# Altium project SparkIO Thermal Shield.PrjPCB
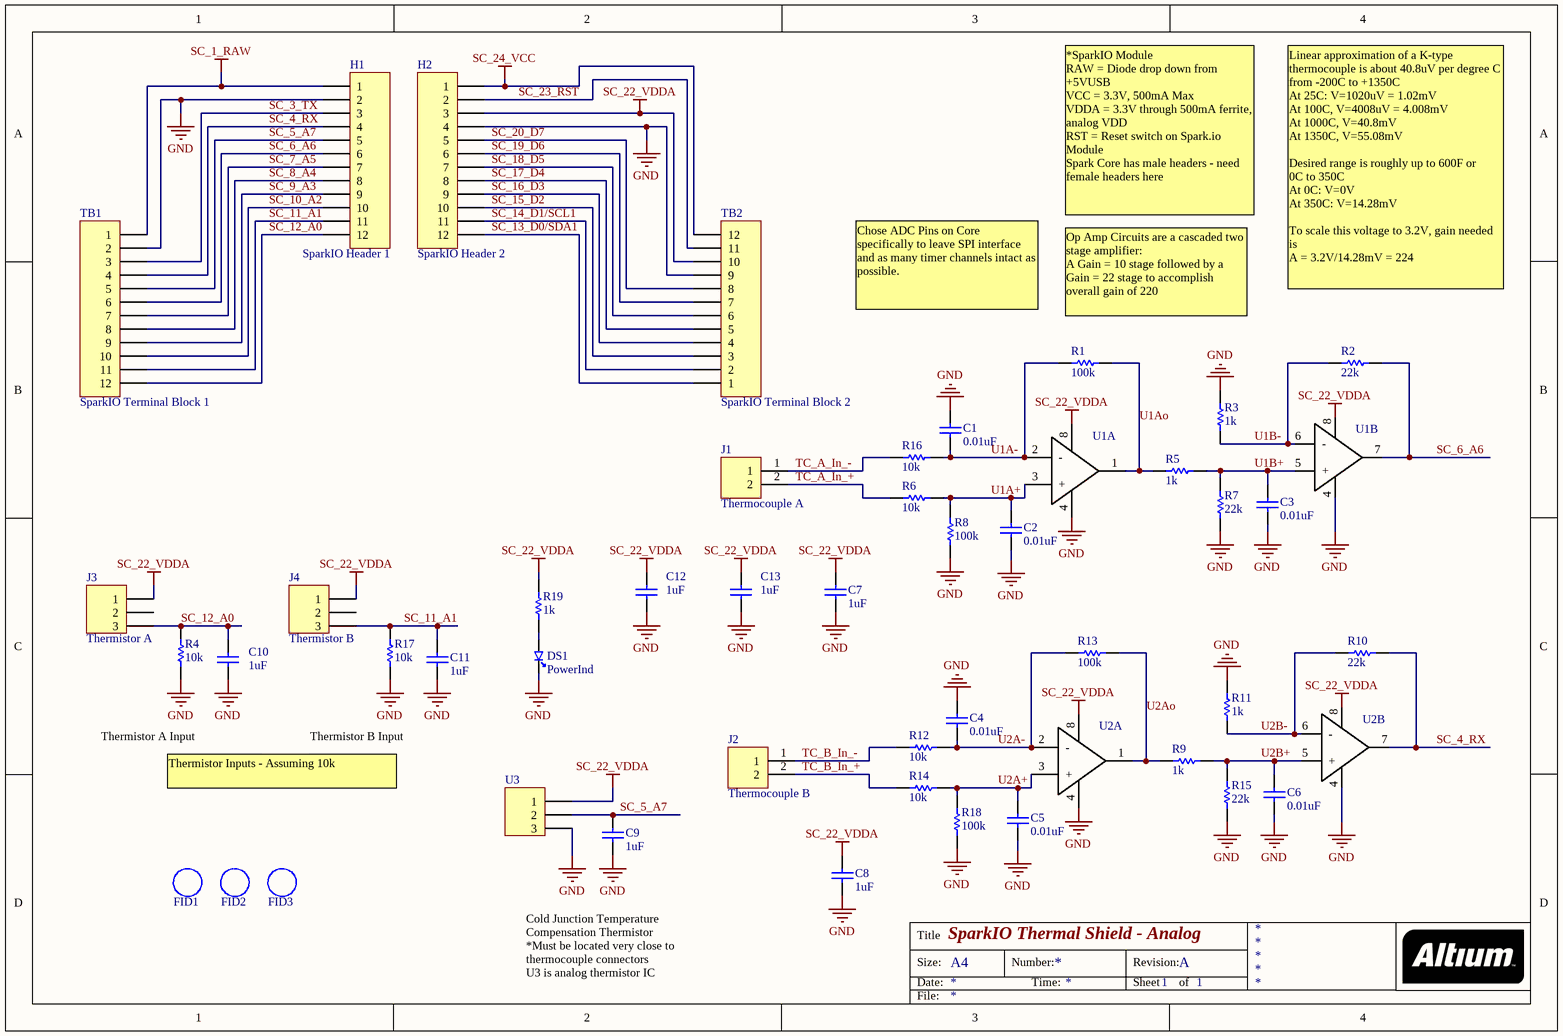
[diagram p0: SparkIO Thermal Shield - No Aux ADC.SchDoc]
1 sheet, 47 parts. Net scope: global (net labels, ports and power ports of the same name join across sheets).
Board files: SparkIO Thermal Shield - Solo PCB.PcbDoc, SparkIO Thermal Shield - Panelized 18x24.PcbDoc, SparkIO Thermal Shield.PcbDoc

## Sheet SparkIO Thermal Shield - No Aux ADC.SchDoc: SparkIO Thermal Shield - Analog
size A4; DrawnBy: Jim Griszbacher; Engineer: Jim Griszbacher; Revision: A; SheetNumber: 1; SheetTotal: 1; ProjectName: SparkIO Thermal Shield

### Parts
C1  value 0.01uF  [0603 - NO SILK]  (hidden comment: Capacitor)
C2  value 0.01uF  [0603 - NO SILK]  (hidden comment: Capacitor)
C3  value 0.01uF  [0603 - NO SILK]  (hidden comment: Capacitor)
C4  value 0.01uF  [0603 - NO SILK]  (hidden comment: Capacitor)
C5  value 0.01uF  [0603 - NO SILK]  (hidden comment: Capacitor)
C6  value 0.01uF  [0603 - NO SILK]  (hidden comment: Capacitor)
C7  value 1uF  [0603 - NO SILK]  (hidden comment: Capacitor)
C8  value 1uF  [0603 - NO SILK]  (hidden comment: Capacitor)
C9  value 1uF  [0603 - NO SILK]  (hidden comment: Capacitor)
C10  value 1uF  [0603 - NO SILK]  (hidden comment: Capacitor)
C11  value 1uF  [0603 - NO SILK]  (hidden comment: Capacitor)
C12  value 1uF  [0603 - NO SILK]  (hidden comment: Capacitor)
C13  value 1uF  [0603 - NO SILK]  (hidden comment: Capacitor)
DS1  PowerInd  [LED0603 - Single]
FID1  Fiducial  [Fiducial_40mil]  (value not drawn)  (no BOM)
FID2  Fiducial  [Fiducial_40mil]  (value not drawn)  (no BOM)
FID3  Fiducial  [Fiducial_40mil]  (value not drawn)  (no BOM)
H1  SparkIO Header 1  [HDR1X12]
H2  SparkIO Header 2  [HDR1X12]
J1  Thermocouple A  [PCC-SMP K Thermocouple]
J2  Thermocouple B  [PCC-SMP K Thermocouple]
J3  Thermistor A  [Audio Jack 2.5mm Mono]
J4  Thermistor B  [Audio Jack 2.5mm Mono]
R1  value 100k  [0603 - NO SILK]  (hidden comment: Resistor)
R2  value 22k  [0603 - NO SILK]  (hidden comment: Resistor)
R3  value 1k  [0603 - NO SILK]  (hidden comment: Resistor)
R4  value 10k  [0603 - NO SILK]  (hidden comment: Resistor)
R5  value 1k  [0603 - NO SILK]  (hidden comment: Resistor)
R6  value 10k  [0603 - NO SILK]  (hidden comment: Resistor)
R7  value 22k  [0603 - NO SILK]  (hidden comment: Resistor)
R8  value 100k  [0603 - NO SILK]  (hidden comment: Resistor)
R9  value 1k  [0603 - NO SILK]  (hidden comment: Resistor)
R10  value 22k  [0603 - NO SILK]  (hidden comment: Resistor)
R11  value 1k  [0603 - NO SILK]  (hidden comment: Resistor)
R12  value 10k  [0603 - NO SILK]  (hidden comment: Resistor)
R13  value 100k  [0603 - NO SILK]  (hidden comment: Resistor)
R14  value 10k  [0603 - NO SILK]  (hidden comment: Resistor)
R15  value 22k  [0603 - NO SILK]  (hidden comment: Resistor)
R16  value 10k  [0603 - NO SILK]  (hidden comment: Resistor)
R17  value 10k  [0603 - NO SILK]  (hidden comment: Resistor)
R18  value 100k  [0603 - NO SILK]  (hidden comment: Resistor)
R19  value 1k  [0603 - NO SILK]  (hidden comment: Resistor)
TB1  SparkIO Terminal Block 1  [Terminal Block 3.5mm x 12]
TB2  SparkIO Terminal Block 2  [Terminal Block 3.5mm x 12]
U1  OPAMP dual  [SOIC8]  (value not drawn)  (parts A,B of 2)
U2  OPAMP dual  [SOIC8]  (value not drawn)  (parts A,B of 2)
U3  Header 3  [SOT23-3L]  (value not drawn)

### Nets
GND: C1.1 C2.2 C3.2 C4.1 C5.2 C6.2 C7.2 C8.2 C9.2 C10.2 C11.2 C12.2 C13.2 DS1.2(K) H1.2 H2.4 R3.1 R4.2 R7.1 R8.1 R11.1 R15.1 R17.2 R18.1 TB1.2 TB2.9 U1.4(V-) U2.4(V-) U3.3
SC_1_RAW: H1.1 TB1.1
SC_22_VDDA: C7.1 C8.1 C12.1 C13.1 H2.3 J3.1 J4.1 R19.1 TB2.10 U1.8(V+) U2.8(V+) U3.1
SC_24_VCC: H2.1 TB2.12
SC_3_TX: H1.3 TB1.3
SC_4_RX: H1.4 R10.1 TB1.4 U2.7(O)
SC_5_A7: C9.1 H1.5 TB1.5 U3.2
SC_6_A6: H1.6 R2.1 TB1.6 U1.7(O)
SC_7_A5: H1.7 TB1.7
SC_8_A4: H1.8 TB1.8
SC_9_A3: H1.9 TB1.9
SC_10_A2: H1.10 TB1.10
SC_11_A1: C11.1 H1.11 J4.3 R17.1 TB1.11
SC_12_A0: C10.1 H1.12 J3.3 R4.1 TB1.12
SC_13_D0/SDA1: H2.12 TB2.1
SC_14_D1/SCL1: H2.11 TB2.2
SC_15_D2: H2.10 TB2.3
SC_16_D3: H2.9 TB2.4
SC_17_D4: H2.8 TB2.5
SC_18_D5: H2.7 TB2.6
SC_19_D6: H2.6 TB2.7
SC_20_D7: H2.5 TB2.8
SC_23_RST: H2.2 TB2.11
TC_A_In_+: J1.2 R6.2
TC_A_In_-: J1.1 R16.2
TC_B_In_+: J2.2 R14.2
TC_B_In_-: J2.1 R12.2
U1A+: C2.1 R6.1 R8.2 U1.3(+)
U1A-: C1.2 R1.2 R16.1 U1.2(-)
U1Ao: R1.1 R5.2 U1.1(O)
U1B+: C3.1 R5.1 R7.2 U1.5(+)
U1B-: R2.2 R3.2 U1.6(-)
U2A+: C5.1 R14.1 R18.2 U2.3(+)
U2A-: C4.2 R12.1 R13.2 U2.2(-)
U2Ao: R9.2 R13.1 U2.1(O)
U2B+: C6.1 R9.1 R15.2 U2.5(+)
U2B-: R10.2 R11.2 U2.6(-)
NetDS1_1: DS1.1(A) R19.2

Not connected (* = marked no-connect by the designer): J3 2; J4 2

### Notes on the sheet
- *SparkIO Module
  RAW = Diode drop down from +5VUSB
  VCC = 3.3V, 500mA Max
  VDDA = 3.3V through 500mA ferrite, analog VDD
  RST = Reset switch on Spark.io Module
  Spark Core has male headers - need female headers here
- Chose ADC Pins on Core specifically to leave SPI interface and as many timer channels intact as possible.
- (near R1) Op Amp Circuits are a cascaded two stage amplifier:
  A Gain = 10 stage followed by a Gain = 22 stage to accomplish overall gain of 220
- Linear approximation of a K-type thermocouple is about 40.8uV per degree C from -200C to +1350C
  At 25C: V=1020uV = 1.02mV
  At 100C, V=4008uV = 4.008mV
  At 1000C, V=40.8mV
  At 1350C, V=55.08mV
  Desired range is roughly up to 600F or
  0C to 350C
  At 0C: V=0V
  At 350C: V=14.28mV
  To scale this voltage to 3.2V, gain needed is
  A = 3.2V/14.28mV = 224
- Thermistor A Input
- Thermistor Inputs - Assuming 10k
- Thermistor B Input
- Cold Junction Temperature Compensation Thermistor
  *Must be located very close to thermocouple connectors
  U3 is analog thermistor IC
- Title
- Size:
- Date:
- A4
- Number:
- Time:
- Revision:
- Sheet
- of
- File:

### Library data of the parts
C1-C6 = Capacitor: Manufacturer: TDK Corporation; Manufacturer Part Number: C1608X7R1E103K080AA; Name: CAP CER 10000PF 25V 10% X7R 0603; Power: 25V; Tolerance: 10%; Fitted/Not Fitted: Fitted; Supplier Part Number 1: 445-5100-1-ND; Package: 0603; Datasheet Link: http://product.tdk.com/en/catalog/datasheets/mlcc_commercial_general_en.pdf; Supplier 1: Digi-Key; Footprint Complete?: Yes
C7-C13 = Capacitor: Manufacturer: TDK Corporation; Manufacturer Part Number: C1608X7R1C105K080AC; Name: CAP CER 1UF 16V 10% X7R 0603; Power: 16V; Tolerance: 10%; Fitted/Not Fitted: Fitted; Supplier Part Number 1: 445-1604-1-ND; Package: 0603; Datasheet Link: http://product.tdk.com/en/catalog/datasheets/mlcc_commercial_general_en.pdf; Supplier 1: Digi-Key; Footprint Complete?: Yes
DS1 = LED Small: LED small symbol; Manufacturer: LiteOn; Manufacturer Part Number: LTST-C190KGKT; Name: Green LED 20mA 2V Vf; Value: Green; Fitted/Not Fitted: Fitted; Datasheet Link: http://optoelectronics.liteon.com/upload/download/DS22-2000-074/S_110_LTST-C190KGKT.pdf; Package: 0603; Supplier 1: Digi-Key; Supplier Part Number 1: 160-1435-1-ND; Footprint Complete?: Yes
FID1-FID3 = Fiducial_1: Fitted/Not Fitted: Fitted; Footprint Complete?: Yes
H1 H2 = Header 12: Header, 12-Pin; Manufacturer: Sullins Interconnect; Manufacturer Part Number: PPTC121LFBN-RC; Name: CONN HEADER FEM 12POS .1" SGL TIN; Value: PPTC121LFBN-RC; Fitted/Not Fitted: Fitted; Supplier 1: Digi-Key; Datasheet Link: http://www.sullinscorp.com/drawings/78_P(N)PxCxxxLFBN-RC,_10492-G.pdf; Package: TH; Supplier Part Number 1: S6100-ND; Footprint Complete?: Yes
J1 J2 = Header 2: Header .1" 2 Pos; Manufacturer: Omega; Manufacturer Part Number: PCC-SMP-K; Name: K Type Thermocouple Mini Horizontal TH Connector; Value: PCC-SMP-K; Fitted/Not Fitted: Fitted; Package: TH; Datasheet Link: http://www.farnell.com/datasheets/1789660.pdf; Supplier 1: Newark; Supplier Part Number 1: 01H0905; Footprint Complete?: Yes
J3 J4 = Header 3: Header .1" 3 Pos; Manufacturer: CUI Inc; Manufacturer Part Number: MJ-2509N; Name: 3/32" Mono Audio Jack Right Angle TH; Value: MJ-2509N; Fitted/Not Fitted: Fitted; Package: TH; Datasheet Link: http://www.cui.com/product/resource/mj-2509n.pdf; Supplier 1: Digi-Key; Supplier Part Number 1: CP-M2509N-ND; Footprint Complete?: Yes
R1 R8 R13 R18 = Resistor: Manufacturer: Vishay; Manufacturer Part Number: CRCW0603100KFKEA; Tolerance: 1%; Power: 1/10W; Name: RES 100K OHM 1/10W 1% 0603 SMD; Fitted/Not Fitted: Fitted; Supplier 1: Digi-Key; Supplier Part Number 1: 541-100KHCT-ND; Package: 0603; Datasheet Link: http://www.vishay.com/docs/20035/dcrcwe3.pdf; Footprint Complete?: Yes
R2 R7 R10 R15 = Resistor: Manufacturer: Vishay; Manufacturer Part Number: CRCW060322K0FKEA; Tolerance: 1%; Power: 1/10W; Name: RES 22.0K OHM 1/10W 1% 0603 SMD; Fitted/Not Fitted: Fitted; Supplier 1: Digi-Key; Supplier Part Number 1: 541-22.0KHCT-ND; Package: 0603; Datasheet Link: http://www.vishay.com/docs/20035/dcrcwe3.pdf; Footprint Complete?: Yes
R3 R5 R9 R11 R19 = Resistor: Manufacturer: Vishay; Manufacturer Part Number: CRCW06031K00FKEA; Tolerance: 1%; Power: 1/10W; Name: RES 1.00K OHM 1/10W 1% 0603 SMD; Fitted/Not Fitted: Fitted; Supplier 1: Digi-Key; Supplier Part Number 1: 541-1.00KHCT-ND; Package: 0603; Datasheet Link: http://www.vishay.com/docs/20035/dcrcwe3.pdf; Footprint Complete?: Yes
R4 R6 R12 R14 R16 R17 = Resistor: Manufacturer: Vishay; Manufacturer Part Number: CRCW060310K0FKEA; Tolerance: 1%; Power: 1/10W; Name: RES 10.0K OHM 1/10W 1% 0603 SMD; Fitted/Not Fitted: Fitted; Supplier 1: Digi-Key; Supplier Part Number 1: 541-10.0KHCT-ND; Package: 0603; Datasheet Link: http://www.vishay.com/docs/20035/dcrcwe3.pdf; Footprint Complete?: Yes
TB1 TB2 = Header 12: Header, 12-Pin; Manufacturer: On Shore Technology; Manufacturer Part Number: OSTTE120104; Name: TERMINAL BLOCK 3.5MM 12POS PCB; Value: OSTTE120104; Fitted/Not Fitted: Fitted; Supplier 1: Digi-Key; Datasheet Link: http://www.on-shore.com/sites/default/files/manuals/OSTTEXX0164.pdf; Package: TH; Supplier Part Number 1: ED2737-ND; Footprint Complete?: Yes
U1 U2 = OPAMP dual: Dual Operational Amplifier; Manufacturer: Texas Instruments; Manufacturer Part Number: OPA2376AIDR; Name: IC Op Amp Dual GBP 5.5MHz 8SOIC; Power: 2.2V to 5.5V; Value: OPA2376AIDR; Fitted/Not Fitted: Fitted; Package: 8-SOIC; Datasheet Link: http://www.ti.com/lit/ds/symlink/opa2376.pdf; Supplier 1: Digi-Key; Supplier Part Number 1: 296-22564-1-ND; Footprint Complete?: Yes
U3 = Header 3: Header .1" 3 Pos; Manufacturer: Microchip; Manufacturer Part Number: TC1046VNBTR; Name: Precision Temperature Sensing IC; Power: 2.7V to 4.4V; Tolerance: +/-0.5C; Value: TC1046; Fitted/Not Fitted: Fitted; Package: SOT23-3; Datasheet Link: http://ww1.microchip.com/downloads/en/DeviceDoc/21496C.pdf; Supplier 1: Digi-Key; Supplier Part Number 1: TC1046VNBTRCT-ND; Footprint Complete?: Yes

## Assembly variants
Prototype: all parts fitted
Bare Board: not fitted C1 C2 C3 C4 C5 C6 C7 C8 C9 C10 C11 C12 C13 DS1 FID1 FID2 FID3 H1 H2 J1 J2 J3 J4 R1 R2 R3 R4 R5 R6 R7 R8 R9 R10 R11 R12 R13 R14 R15 R16 R17 R18 R19 TB1 TB2 U1 U2 U3